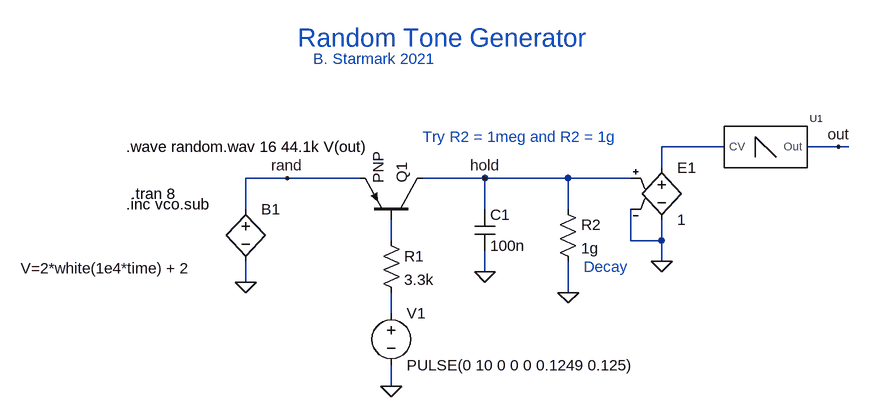
[diagram p0: schematic random.asc]
random.asc, the LTspice schematic file:
Version 4
SHEET 1 1268 680
WIRE 864 80 768 80
WIRE 1040 80 992 80
WIRE 1056 80 1040 80
WIRE 768 112 768 80
WIRE 192 128 128 128
WIRE 304 128 192 128
WIRE 496 128 400 128
WIRE 624 128 496 128
WIRE 720 128 624 128
WIRE 128 176 128 128
WIRE 496 176 496 128
WIRE 624 176 624 128
WIRE 352 224 352 192
WIRE 720 224 720 176
WIRE 768 224 768 192
WIRE 768 224 720 224
WIRE 768 256 768 224
WIRE 496 272 496 240
WIRE 128 288 128 256
WIRE 624 304 624 256
WIRE 352 336 352 304
WIRE 352 448 352 416
FLAG 128 288 0
FLAG 192 128 rand
FLAG 1040 80 out
FLAG 496 272 0
FLAG 352 448 0
FLAG 768 256 0
FLAG 496 128 hold
FLAG 624 304 0
SYMBOL bv 128 160 R0
WINDOW 3 -346 107 Left 2
SYMATTR InstName B1
SYMATTR Value V=2*white(1e4*time) + 2
SYMBOL vco 928 32 R0
SYMATTR InstName U1
SYMBOL pnp 400 192 M270
SYMATTR InstName Q1
SYMBOL res 336 208 R0
SYMATTR InstName R1
SYMATTR Value 3.3k
SYMBOL cap 480 176 R0
SYMATTR InstName C1
SYMATTR Value 100n
SYMBOL voltage 352 320 R0
WINDOW 123 0 0 Left 0
WINDOW 39 0 0 Left 0
SYMATTR InstName V1
SYMATTR Value PULSE(0 10 0 0 0 0.1249 0.125)
SYMBOL e 768 96 R0
SYMATTR InstName E1
SYMATTR Value 1
SYMBOL res 608 160 R0
SYMATTR InstName R2
SYMATTR Value 1g
TEXT -48 152 Left 2 !.tran 8
TEXT -56 80 Left 2 !.wave random.wav 16 44.1k V(out)
TEXT -56 168 Left 2 !.inc vco.sub
TEXT 208 -88 Left 4 ;Random Tone Generator
TEXT 232 -56 Left 2 ;B. Starmark 2021
TEXT 648 264 Left 2 ;Decay
TEXT 400 64 Left 2 ;Try R2 = 1meg and R2 = 1g

The netlist it stands for:
* random.asc
B1 rand 0 V=2*white(1e4*time) + 2
XU1 N001 out vco  ; pins CV Out
Q1 hold N002 rand 0 PNP
R1 N002 N003 3.3k
C1 hold 0 100n
V1 N003 0 PULSE(0 10 0 0 0 0.1249 0.125)
E1 N001 0 hold 0 1
R2 hold 0 1g
.model NPN NPN
.model PNP PNP
.lib standard.bjt
.tran 8
.wave random.wav 16 44.1k V(out)
.inc vco.sub
* Random Tone Generator
* B. Starmark 2021
* Decay
* Try R2 = 1meg and R2 = 1g
.backanno
.end